# Altium project motor_driver.PrjPcb
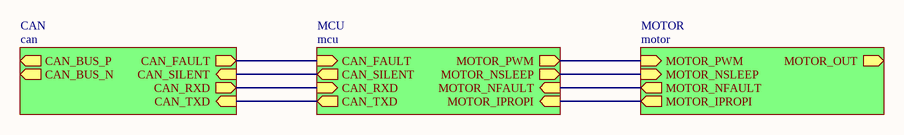
[diagram p0: top.SchDoc]
4 sheets, 15 parts. Net scope: hierarchical (ports join the sheet entries above them; power ports are global).
Sheets:
  top.SchDoc
    MCU = mcu.SchDoc
    CAN = can.SchDoc
    MOTOR = motor.SchDoc

## Sheet top.SchDoc
size A4; SheetNumber: 1; SheetTotal: 4

### Sub-sheets
CAN = can: CAN_TXD (in), CAN_RXD (out), CAN_FAULT (out), CAN_SILENT (in), CAN_BUS_P (out), CAN_BUS_N (out)
MCU = mcu: CAN_TXD (out), CAN_SILENT (out), CAN_RXD (in), CAN_FAULT (in), MOTOR_PWM (out), MOTOR_NSLEEP (out), MOTOR_NFAULT (in), MOTOR_IPROPI (in)
MOTOR = motor: MOTOR_OUT (out), MOTOR_PWM (in), MOTOR_NSLEEP (in), MOTOR_NFAULT (out), MOTOR_IPROPI (out)

### Nets
CAN_FAULT: sheet MCU/CAN_FAULT, sheet CAN/CAN_FAULT
CAN_RXD: sheet MCU/CAN_RXD, sheet CAN/CAN_RXD
CAN_SILENT: sheet MCU/CAN_SILENT, sheet CAN/CAN_SILENT
CAN_TXD: sheet MCU/CAN_TXD, sheet CAN/CAN_TXD
MOTOR_IPROPI: sheet MCU/MOTOR_IPROPI, sheet MOTOR/MOTOR_IPROPI
MOTOR_NFAULT: sheet MCU/MOTOR_NFAULT, sheet MOTOR/MOTOR_NFAULT
MOTOR_NSLEEP: sheet MCU/MOTOR_NSLEEP, sheet MOTOR/MOTOR_NSLEEP
MOTOR_PWM: sheet MCU/MOTOR_PWM, sheet MOTOR/MOTOR_PWM

## Sheet mcu.SchDoc
size A4; SheetNumber: 2; SheetTotal: 4
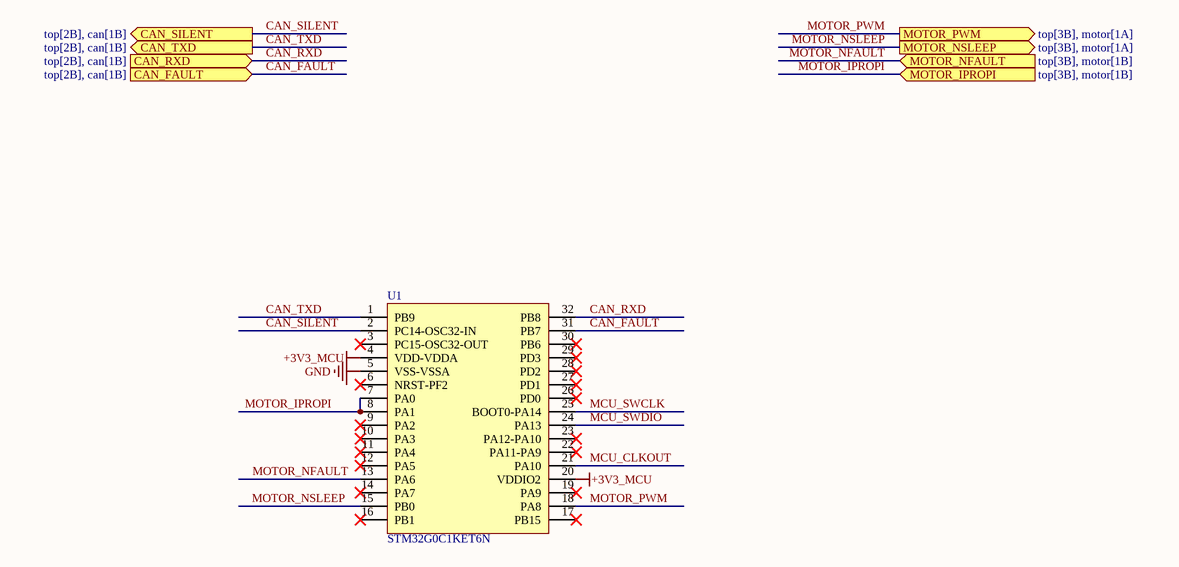
[diagram p1: mcu.SchDoc]

### Parts
U1  STM32G0C1KET6N  [STM32G0C1KET6N]

### Ports
CAN_FAULT (in, see top[2B], can[1B]), CAN_RXD (in, see top[2B], can[1B]), CAN_SILENT (out, see top[2B], can[1B]), CAN_TXD (out, see top[2B], can[1B]), MOTOR_IPROPI (in, see top[3B], motor[1B]), MOTOR_NFAULT (in, see top[3B], motor[1B]), MOTOR_NSLEEP (out, see top[3B], motor[1A]), MOTOR_PWM (out, see top[3B], motor[1A])

### Nets
+3V3_MCU: U1.4(VDD-VDDA) U1.20(VDDIO2)
GND: U1.5(VSS-VSSA)
CAN_FAULT: U1.31(PB7) ; port CAN_FAULT
CAN_RXD: U1.32(PB8) ; port CAN_RXD
CAN_SILENT: U1.2(PC14-OSC32-IN) ; port CAN_SILENT
CAN_TXD: U1.1(PB9) ; port CAN_TXD
MCU_CLKOUT: U1.21(PA10)
MCU_SWCLK: U1.25(BOOT0-PA14)
MCU_SWDIO: U1.24(PA13)
MOTOR_IPROPI: U1.7(PA0) U1.8(PA1) ; port MOTOR_IPROPI
MOTOR_NFAULT: U1.13(PA6) ; port MOTOR_NFAULT
MOTOR_NSLEEP: U1.15(PB0) ; port MOTOR_NSLEEP
MOTOR_PWM: U1.18(PA8) ; port MOTOR_PWM

Not connected (* = marked no-connect by the designer): U1 3(PC15-OSC32-OUT)* 6(NRST-PF2)* 9(PA2)* 10(PA3)* 11(PA4)* 12(PA5)* 14(PA7)* 16(PB1)* 17(PB15)* 19(PA9)* 22(PA11-PA9)* 23(PA12-PA10)* 26(PD0)* 27(PD1)* 28(PD2)* 29(PD3)* 30(PB6)*

### Library data of the parts
U1 = STM32G0C1KET6N: STM32 MCU; Supplier 1: Mouser; Supplier Part Number 1: 511-STM32G0C1KET6

## Sheet can.SchDoc
size A4; SheetNumber: 3; SheetTotal: 4
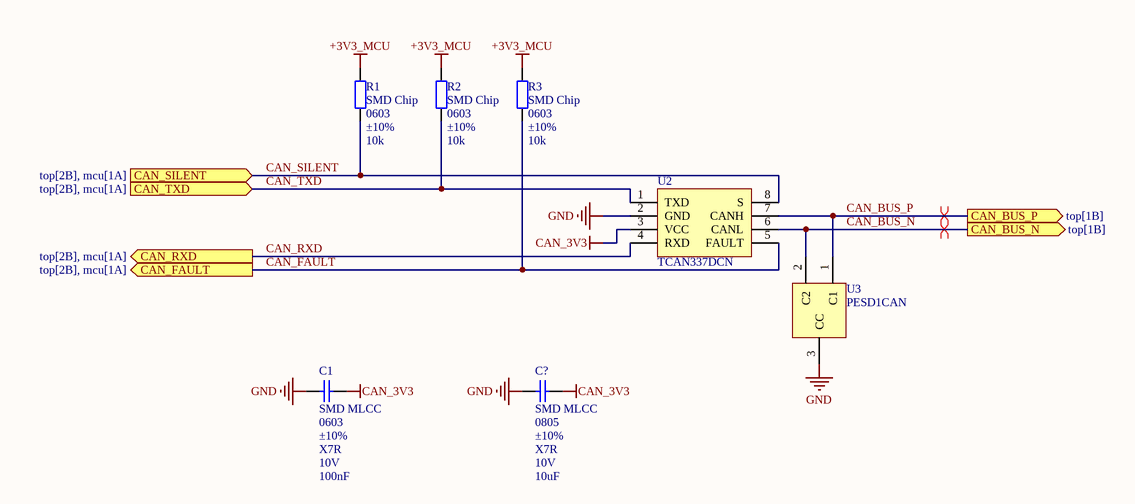
[diagram p2: can.SchDoc]

### Parts
C1  SMD MLCC  Size: 0603  Tolerance: ±10%  Dielectric: X7R  VoltageRating: 10V  Capacitance: 100nF  [SMD_MLCC_CAPACITOR_0603]
C?  SMD MLCC  Size: 0805  Tolerance: ±10%  Dielectric: X7R  VoltageRating: 10V  Capacitance: 10uF  [SMD_MLCC_CAPACITOR_0805]
R1  SMD Chip  Size: 0603  Tolerance: ±10%  Resistance: 10k  [SMD_CHIP_RESISTOR_0603]
R2  SMD Chip  Size: 0603  Tolerance: ±10%  Resistance: 10k  [SMD_CHIP_RESISTOR_0603]
R3  SMD Chip  Size: 0603  Tolerance: ±10%  Resistance: 10k  [SMD_CHIP_RESISTOR_0603]
U2  TCAN337DCN  [TCAN337DCN]
U3  PESD1CAN  [PESD1CAN]

### Ports
CAN_BUS_N (out, see top[1B]), CAN_BUS_P (out, see top[1B]), CAN_FAULT (out, see top[2B], mcu[1A]), CAN_RXD (out, see top[2B], mcu[1A]), CAN_SILENT (in, see top[2B], mcu[1A]), CAN_TXD (in, see top[2B], mcu[1A])

### Nets
+3V3_MCU: R1.2 R2.2 R3.2
CAN_3V3: C1.2 C?.2 U2.3(VCC)
GND: C1.1 C?.1 U2.2(GND) U3.3(CC)
CAN_BUS_N: U2.6(CANL) U3.2(C2) ; port CAN_BUS_N
CAN_BUS_P: U2.7(CANH) U3.1(C1) ; port CAN_BUS_P
CAN_FAULT: R3.1 U2.5(FAULT) ; port CAN_FAULT
CAN_RXD: U2.4(RXD) ; port CAN_RXD
CAN_SILENT: R1.1 U2.8(S) ; port CAN_SILENT
CAN_TXD: R2.1 U2.1(TXD) ; port CAN_TXD

### Layout directives
differential pair: CAN_BUS_N, CAN_BUS_P

### Library data of the parts
C1 C? = SMD MLCC Capacitor: generic SMD MLCC capacitor
R1-R3 = SMD Chip Resistor: generic SMD chip resistor; PowerRating: /
U2 = TCAN337DCN: CAN physical; Supplier 1: Mouser; Supplier Part Number 1: 595-TCAN337DCNT
U3 = PESD1CAN: CAN ESD protection; Supplier 1: Future Electronics; Supplier Part Number 1: 6297154

## Sheet motor.SchDoc
size A4; SheetNumber: 4; SheetTotal: 4
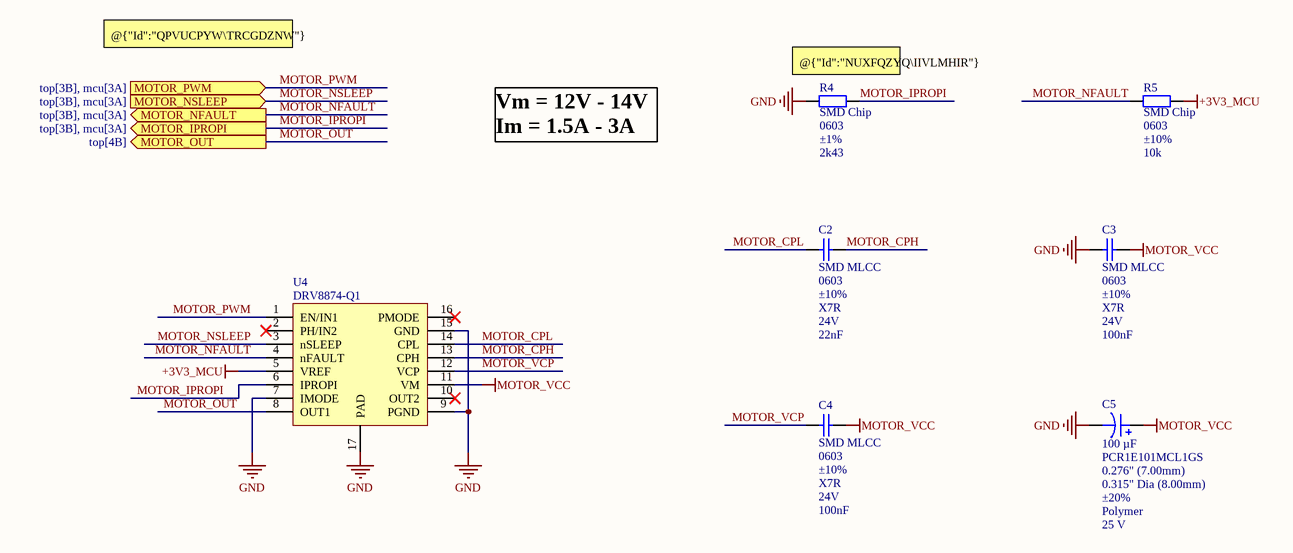
[diagram p3: motor.SchDoc]

### Parts
C2  SMD MLCC  Size: 0603  Tolerance: ±10%  Dielectric: X7R  VoltageRating: 24V  Capacitance: 22nF  [SMD_MLCC_CAPACITOR_0603]
C3  SMD MLCC  Size: 0603  Tolerance: ±10%  Dielectric: X7R  VoltageRating: 24V  Capacitance: 100nF  [SMD_MLCC_CAPACITOR_0603]
C4  SMD MLCC  Size: 0603  Tolerance: ±10%  Dielectric: X7R  VoltageRating: 24V  Capacitance: 100nF  [SMD_MLCC_CAPACITOR_0603]
C5  100 µF  Part Number: PCR1E101MCL1GS  Height - Seated (Max): 0.276" (7.00mm)  Size / Dimension: 0.315" Dia (8.00mm)  Tolerance: ±20%  Type: Polymer  Voltage - Rated: 25 V  [CAP ALSMD POLY 8.3MM H7.0MM]
R4  SMD Chip  Size: 0603  Tolerance: ±1%  Resistance: 2k43  [SMD_CHIP_RESISTOR_0603]
R5  SMD Chip  Size: 0603  Tolerance: ±10%  Resistance: 10k  [SMD_CHIP_RESISTOR_0603]
U4  DRV8874-Q1  [DRV8874-Q1]

### Ports
MOTOR_IPROPI (out, see top[3B], mcu[3A]), MOTOR_NFAULT (out, see top[3B], mcu[3A]), MOTOR_NSLEEP (in, see top[3B], mcu[3A]), MOTOR_OUT (out, see top[4B]), MOTOR_PWM (in, see top[3B], mcu[3A])

### Nets
+3V3_MCU: R5.2 U4.5(VREF)
GND: C3.2 C5.2 R4.1 U4.7(IMODE) U4.9(PGND) U4.15(GND) U4.17(PAD)
MOTOR_VCC: C3.1 C4.2 C5.1 U4.11(VM)
MOTOR_CPH: C2.2 U4.13(CPH)
MOTOR_CPL: C2.1 U4.14(CPL)
MOTOR_IPROPI: R4.2 U4.6(IPROPI) ; port MOTOR_IPROPI
MOTOR_NFAULT: R5.1 U4.4(nFAULT) ; port MOTOR_NFAULT
MOTOR_NSLEEP: U4.3(nSLEEP) ; port MOTOR_NSLEEP
MOTOR_OUT: U4.8(OUT1) ; port MOTOR_OUT
MOTOR_PWM: U4.1(EN/IN1) ; port MOTOR_PWM
MOTOR_VCP: C4.1 U4.12(VCP)

Not connected (* = marked no-connect by the designer): U4 2(PH/IN2)* 10(OUT2)* 16(PMODE)*

### Notes on the sheet
- @{"Id":"QPVUCPYW\TRCGDZNW"} max 100kHz
- (near R4) @{"Id":"NUXFQZYQ\IIVLMHIR"} Iod <= 5mA
- Vm = 12V - 14V
  Im = 1.5A - 3A

### Library data of the parts
C2-C4 = SMD MLCC Capacitor: generic SMD MLCC capacitor
C5 = PCR1E101MCL1GS: CAP ALUM POLY 100UF 20% 25V SMD; manufacturer: Nichicon; ESR (Equivalent Series Resistance): 41mOhm; Lifetime @ Temp.: 4000 Hrs @ 125°C; Ripple Current @ High Frequency: 1.2 A @ 100 kHz; Surface Mount Land Size: 0.327" L x 0.327" W (8.30mm x 8.30mm); Applications: Automotive; Capacitance: 100 µF; componentlink1description: Datasheet; componentlink1url: http://nichicon-us.com/english/products/pdfs/e-pcr.pdf; componentlink2description: DigiKey Link; componentlink2url: https://www.digikey.com/en/products/detail/nichicon/PCR1E101MCL1GS/4694651; Device Package: Radial, Can - SMD; lastupdated: 1. 12. 2023 21:37:41; Lifecycle Status: Active; Minimum Order: 1; Mounting Type: Surface Mount; Operating Temperature: -55°C ~ 125°C; Package / Case: Radial, Can - SMD; packaging: TapeAndReel; partid: 2447; Part Status: Active; price: 0.76; Ratings: AEC-Q200; series: PCR; Supplier 1: DigiKey; Supplier Part Number 1: 493-13751-1-ND; value: 100 µF
R4 R5 = SMD Chip Resistor: as R1 on sheet can
U4 = DRV8874-Q1: brushed DC motor driver; Supplier 1: Mouser; Supplier Part Number 1: 595-DRV8874QPWPRQ1

## Nets that join several sheets
+3V3_MCU: mcu (U1.4 U1.20), can (R1.2 R2.2 R3.2), motor (R5.2 U4.5)
GND: mcu (U1.5), can (C1.1 C?.1 U2.2 U3.3), motor (7 pins)
CAN_FAULT: mcu (U1.31), can (R3.1 U2.5)
CAN_RXD: mcu (U1.32), can (U2.4)
CAN_SILENT: mcu (U1.2), can (R1.1 U2.8)
CAN_TXD: mcu (U1.1), can (R2.1 U2.1)
MOTOR_IPROPI: mcu (U1.7 U1.8), motor (R4.2 U4.6)
MOTOR_NFAULT: mcu (U1.13), motor (R5.1 U4.4)
MOTOR_NSLEEP: mcu (U1.15), motor (U4.3)
MOTOR_PWM: mcu (U1.18), motor (U4.1)